# EAGLE design 207_temperature (EAGLE 7.6.0)
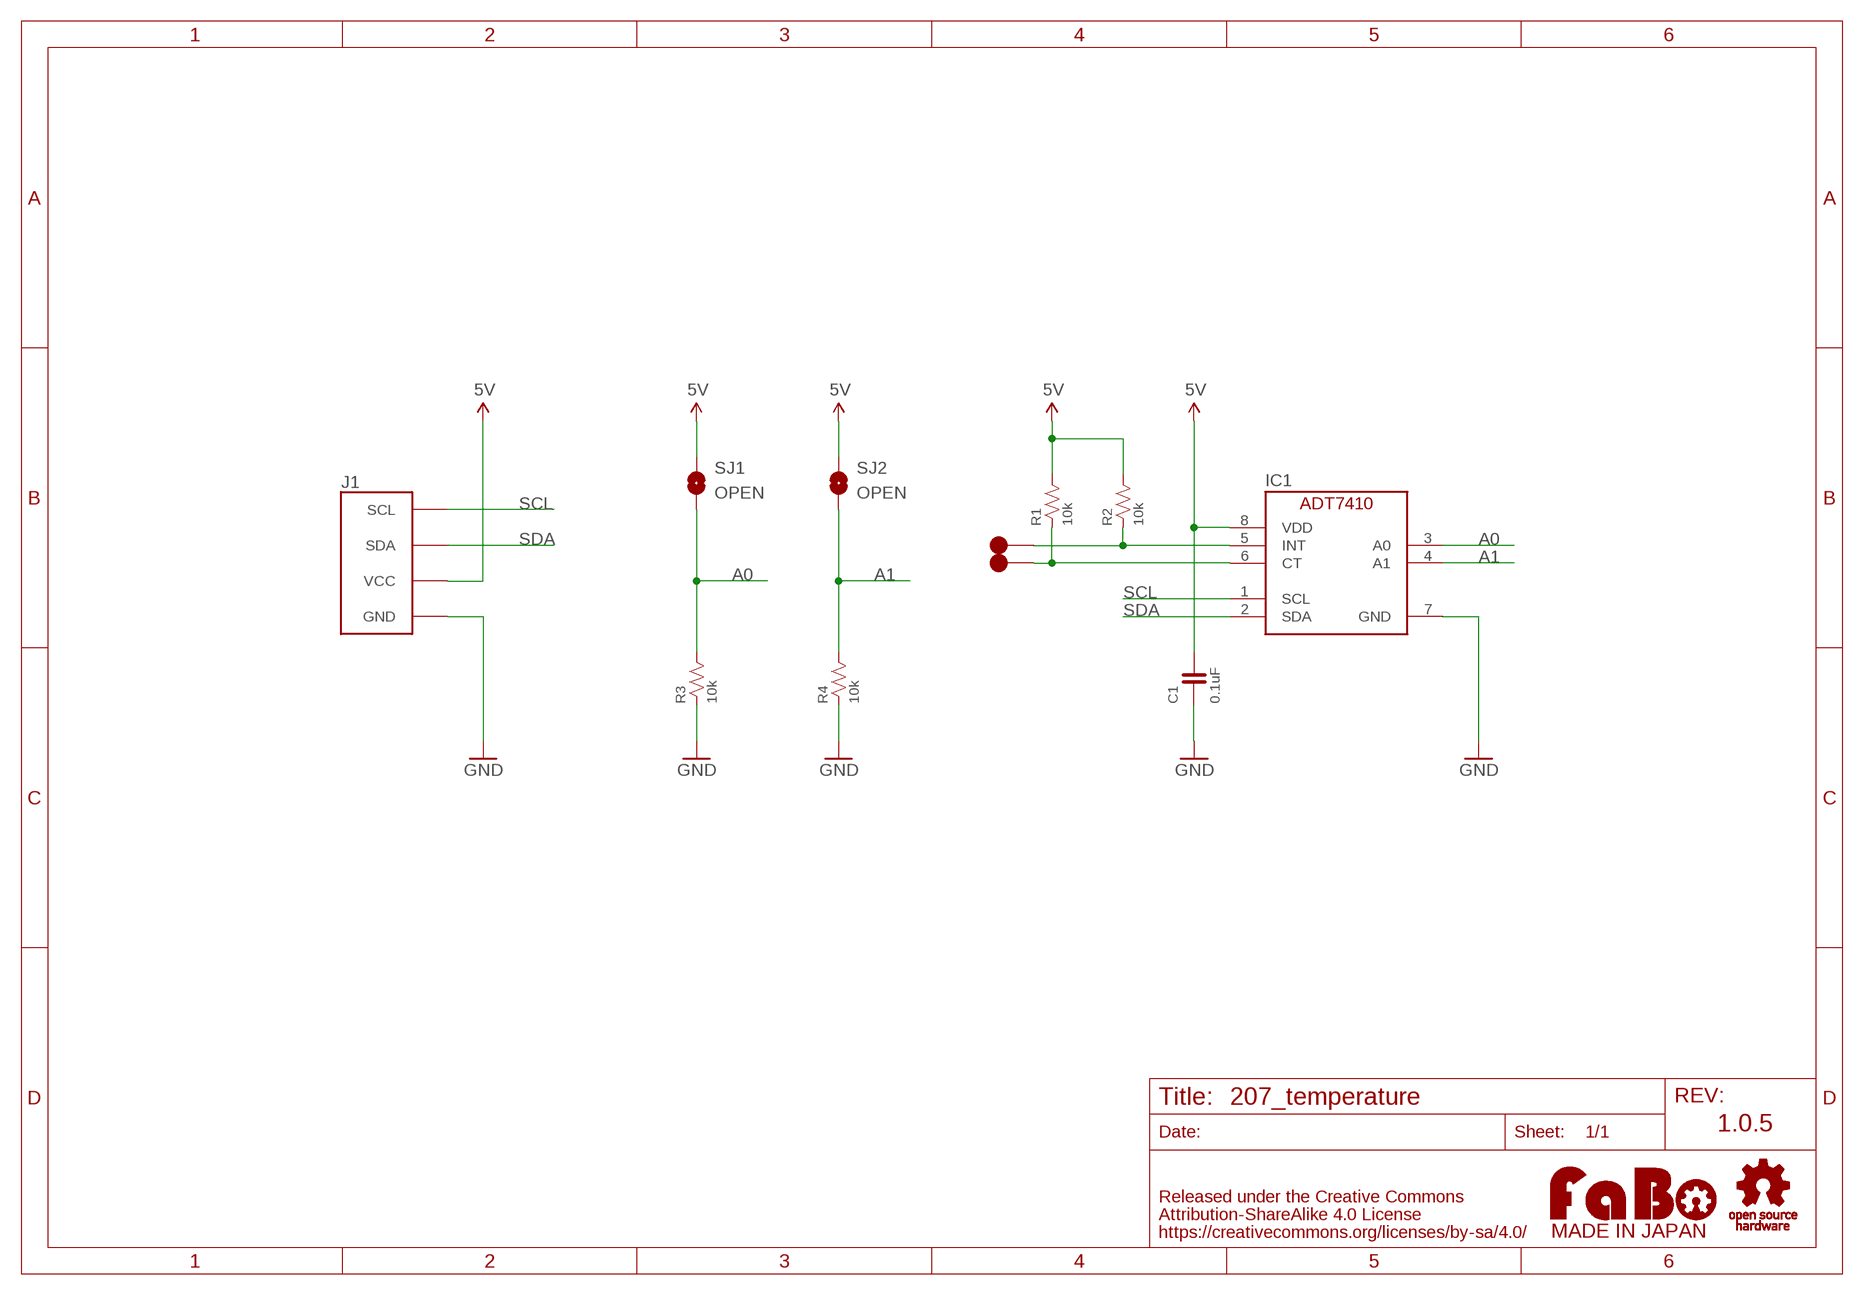
[diagram p0: schematic, sheet 1]

## Parts
C1  0.1uF  CAPACITOR-0603  [0603]
IC1  AD-ADT7410  [ANALOGDEVICES-ADT7410]
J1  FABO_BRICK_I2C  [FABO_BRICK_I2C]
R1  10k  RESISTOR-0603  [0603]
R2  10k  RESISTOR-0603  [0603]
R3  10k  RESISTOR-0603  [0603]
R4  10k  RESISTOR-0603  [0603]
SJ1  OPEN  SMD-JUMPER-2-OPEN  [SMD-JUMPER-2-OPEN]
SJ2  OPEN  SMD-JUMPER-2-OPEN  [SMD-JUMPER-2-OPEN]
TP1  TP-15  [TP-15]
TP2  TP-15  [TP-15]
U$1  LOGO_OSHW-M_BOTTOM  [LOGO_OSHW_M_BOTTOM]
U$3  LOGO_FABO-M  [LOGO_FABO_MS]

## Nets
5V: C1.2 IC1.8(VDD) J1.VCC R1.2 R2.2 SJ1.1 SJ2.1
A0: IC1.3(A0) R3.2 SJ1.2
A1: IC1.4(A1) R4.2 SJ2.2
GND: C1.1 IC1.7(GND) J1.GND R3.1 R4.1
N$1: IC1.6(CT) R1.1 TP2.1
N$2: IC1.5(INT) R2.1 TP1.1
SCL: IC1.1(SCL) J1.SCL
SDA: IC1.2(SDA) J1.SDA

## Notes on the sheet
- 1.0.5

## Library data of the parts
C1 = FaBo-Capacitor:CAPACITOR: CAPACITOR
IC1 = FaBo-Mems:AD-ADT7410: ANALOGDEVICES ADT7410(Temperature)
J1 = FaBo-Template:FABO_BRICK_I2C: FaBo Brick I2C
R1-R4 = FaBo-Resistors:RESISTOR: RESISTOR
SJ1 SJ2 = FaBo-Supply:SMD-JUMPER-2
TP1 TP2 = FaBo-Supply:TP
U$1 = FaBo-etc:LOGO_OSHW
U$3 = FaBo-etc:LOGO_FABO

## Board
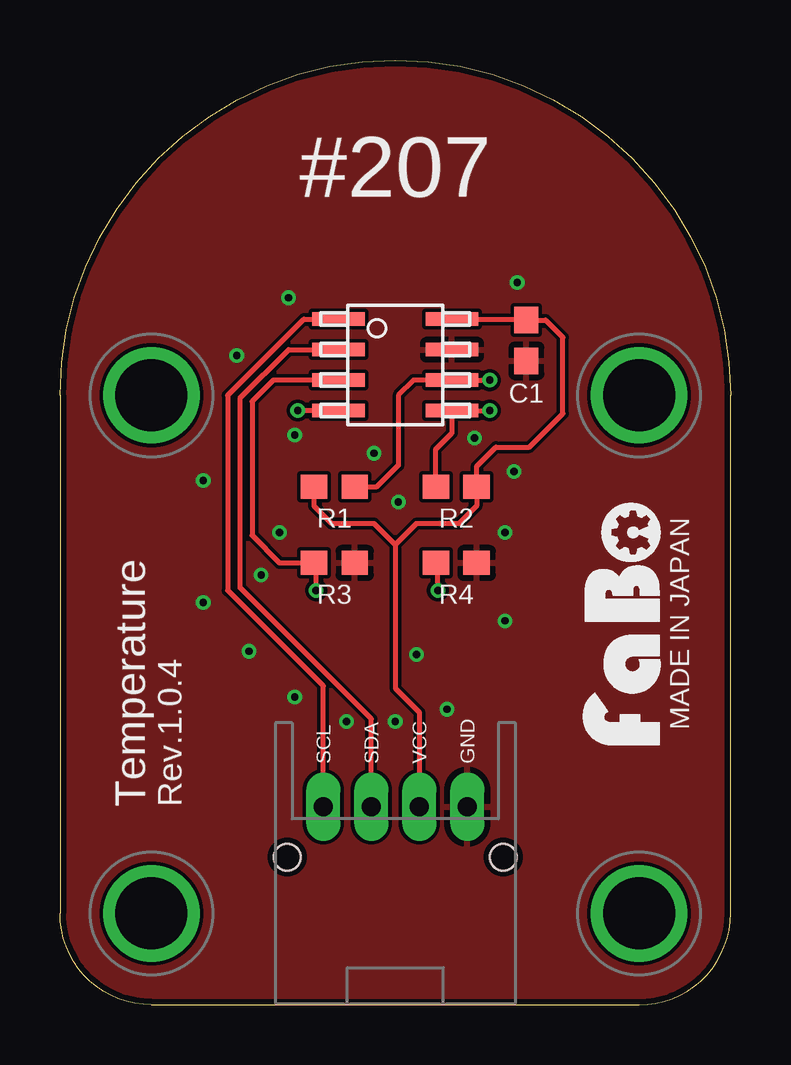
[diagram p1: board, top side]
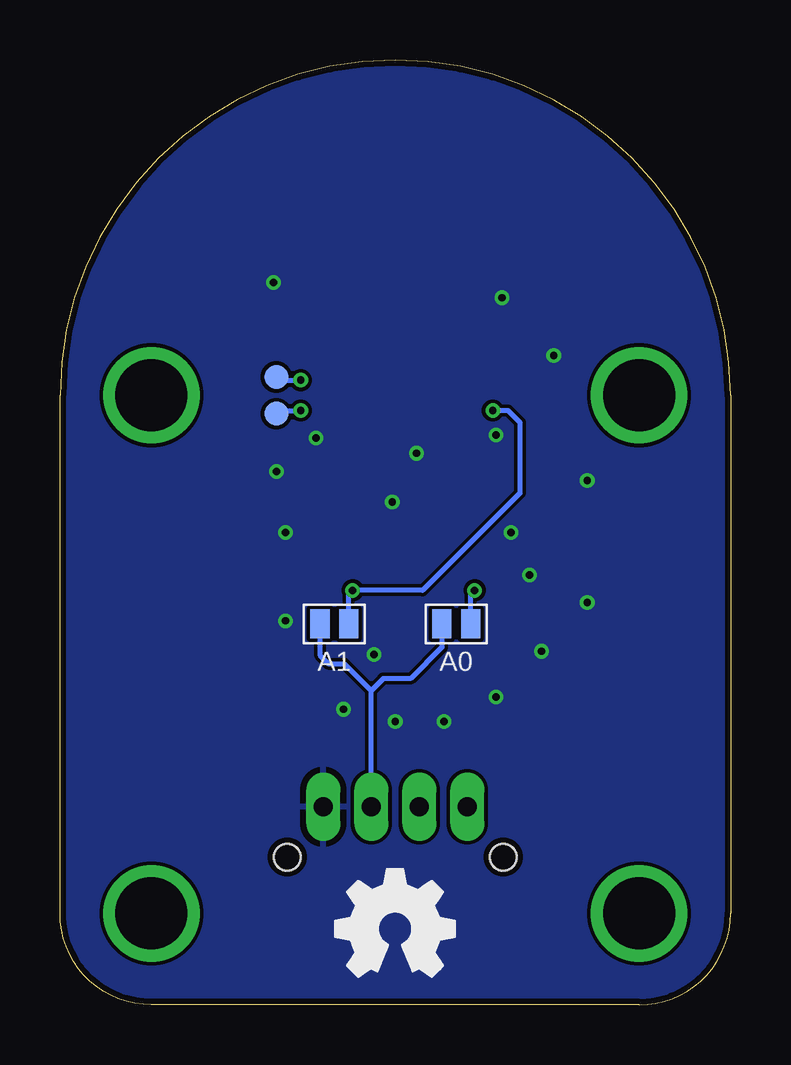
[diagram p2: board, bottom side, seen from below]

Size 27.94 x 39.37 mm. Coordinates in mm from the lower left corner, seen from the top.
Copper layers (1*16): Top 0.035mm / dielectric 1.5mm / Bottom 0.035mm
Design rules "SeeedStudio_2layer_DRU_no_angle_20140221": minimum track width 6mil, minimum drill 12mil, track to track 6mil, track to pad 6mil, pad to pad 6mil, via to via 6mil, smd to smd 0mil, copper to edge 10mil, drill to drill 10mil, minimum pad ring 10mil, minimum via ring 6mil, stop-mask expansion 2mil, vias tented up to drill 100mil, thermal gap 10mil

### Footprints (pad centres in the part's own frame; a part is rotated, then mirrored left to right if it is on the bottom)
0603 = smd 1.1 x 1: 1 -0.85,0; 2 0.85,0
ANALOGDEVICES-ADT7410 = smd 2.184 x 0.559: 1 -2.362,1.905; 2 -2.362,0.635; 3 -2.362,-0.635; 4 -2.362,-1.905; 5 2.362,-1.905; 6 2.362,-0.635; 7 2.362,0.635; 8 2.362,1.905
FABO_BRICK_I2C = drill 0.8 pad 1.422 long: GND 3,-10.795; SCL -3,-10.795; SDA -1,-10.795; VCC 1,-10.795 | drill 3 pad 3.81: P$1 -10.16,6.35; P$2 10.16,6.35; P$3 -10.16,-15.24; P$4 10.16,-15.24 | hole 1.1: -4.5,-12.895; 4.5,-12.895
SMD-JUMPER-2-OPEN = smd 0.8 x 1.2: 1 -0.6,0; 2 0.6,0
TP-10 = smd 1 x 1: 1 0,0

### Placement (x,y rotation side)
C1  19.43,27.69 90 top
IC1  13.97,26.67 0 top
J1  13.97,19.05 0 top
R1  11.43,21.59 180 top
R2  16.51,21.59 0 top
R3  11.43,18.41 180 top
R4  16.51,18.41 180 top
SJ1  11.43,15.88 0 bottom
SJ2  16.51,15.88 0 bottom
TP1  [TP-10]  18.92,24.64 0 bottom
TP2  [TP-10]  18.92,26.16 0 bottom
U$1  13.97,3.17 0 top
U$3  25.4,15.88 90 top

### Tracks (layer width: path | path; a pad name or v marks a point on that pad's centre or on a via)
5V
  Top 0.203: R1.2 10.58,20.79 11.3,20.07 13.08,20.07 13.97,19.18 | 13.97,19.18 14.86,20.07 16.64,20.07 17.36,20.79 R2.2 17.36,22.44 18.16,23.24 19.56,23.24 20.95,24.64 20.95,27.81 20.23,28.54 C1.2 19.18,28.54 19.14,28.57 IC1.8 | 13.97,19.18 13.97,13.19 14.97,12.19 J1.VCC
  Bottom 0.203: SJ2.1 17.11,14.57 16.76,14.22 16.1,14.22 14.97,13.1 | SJ1.1 12.03,14.89 13.34,13.59 14.48,13.59 14.97,13.1 | J1.VCC 14.97,13.1
A0  (via drill 0.3)
  Top 0.203: v10.67,17.27 10.67,18.33 R3.2 9.14,18.41 8,19.56 8,25.15 8.89,26.04 IC1.3
  Bottom 0.203: SJ1.2 10.83,17.11 v10.67,17.27
A1  (via drill 0.3)
  Top 0.203: v15.75,17.27 15.75,18.33 R4.2 | IC1.4 v9.91,24.77
  Bottom 0.203: SJ2.2 15.91,17.11 v15.75,17.27 12.83,17.27 8.76,21.34 8.76,24.26 9.27,24.77 v9.91,24.77
GND  (via drill 0.3)
  other vias: 8.38,17.91 13.97,11.81 7.87,14.73 11.94,11.81 5.97,16.76 9.78,12.83 5.97,21.84 9.14,19.68 9.78,23.75 7.37,27.05 13.08,22.99 16.13,12.32 14.86,14.61 18.92,22.23 17.27,23.62 19.05,30.1 9.53,29.46 18.54,16 18.54,19.68 14.1,20.95
  pour Bottom: 0,0 27.94,0 27.94,39.37 0,39.37
  pour Top: 0,0 27.94,0 27.94,39.37 0,39.37
N$1  (via drill 0.3)
  Top 0.203: R1.1 13.21,21.59 14.1,22.48 14.1,25.4 14.73,26.04 IC1.6 v17.91,26.04
  Bottom 0.203: TP2.1 18.8,26.04 v17.91,26.04
N$2  (via drill 0.3)
  Top 0.203: R2.1 15.66,23.15 16.33,23.82 IC1.5 v17.91,24.77
  Bottom 0.203: TP1.1 18.8,24.77 v17.91,24.77
SCL
  Top 0.203: IC1.1 10.16,28.57 6.99,25.4 6.99,17.27 10.97,13.29 J1.SCL
SDA
  Top 0.203: IC1.2 9.53,27.3 7.49,25.27 7.49,17.4 12.97,11.92 J1.SDA

### Text on the board
tPlace: #207 | MADE IN JAPAN | Temperature | Rev.1.0.4
bPlace: A0 | A1